# Altium schematic sheet 继电器控制原理图.SCHDOC
size A4
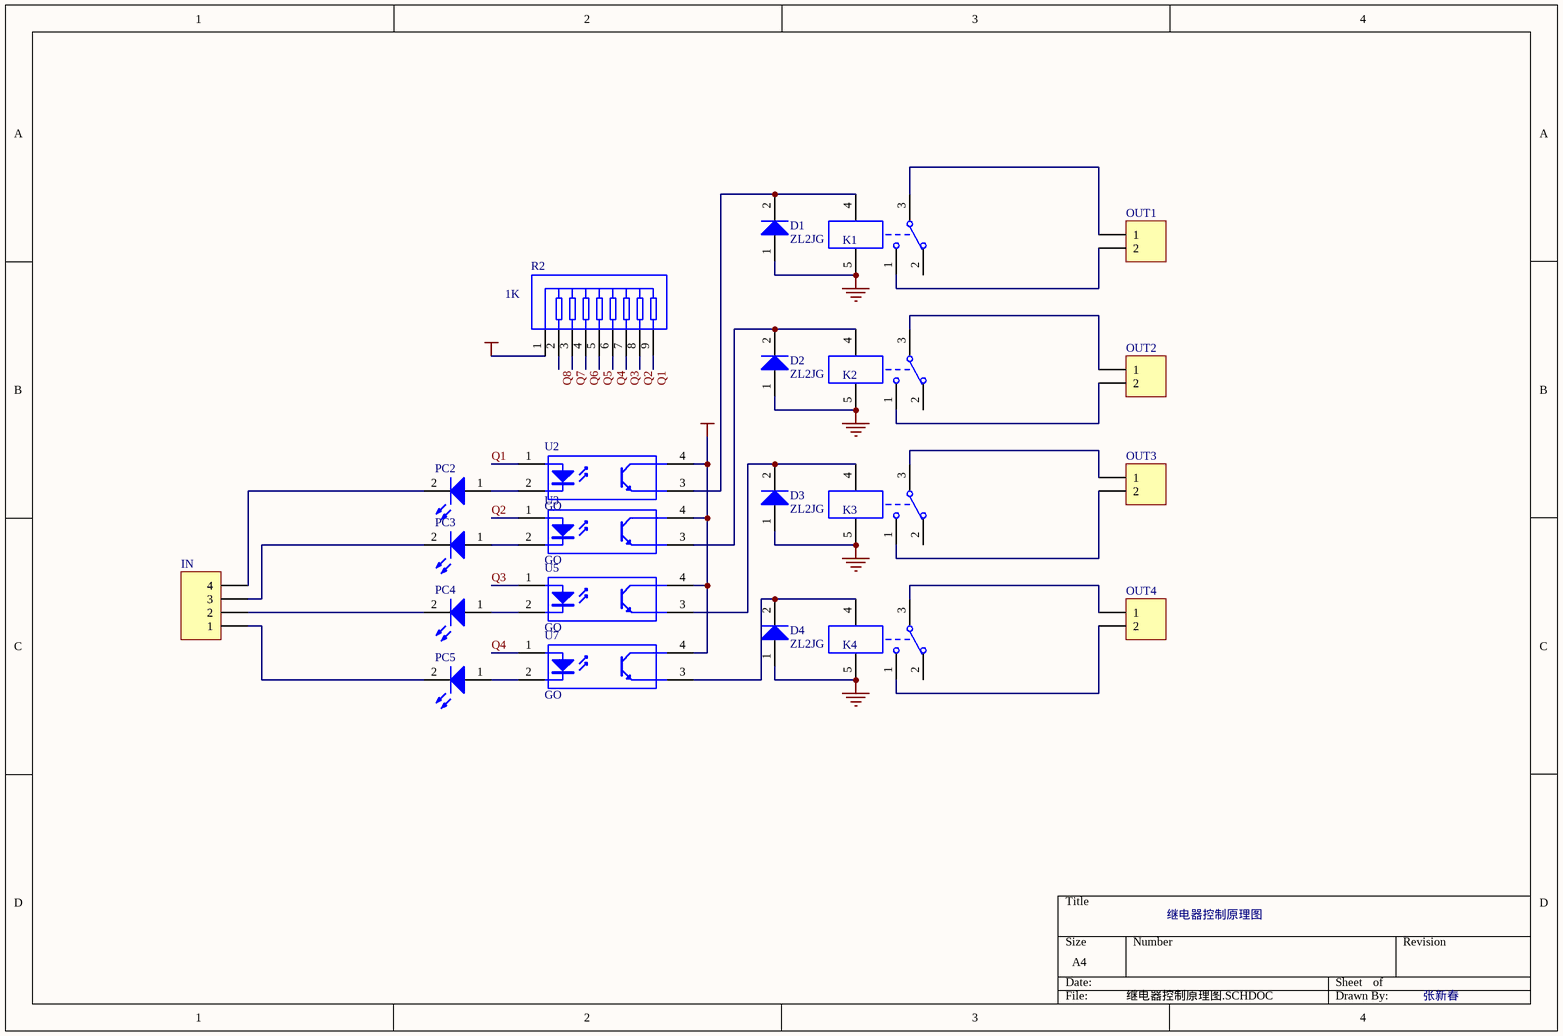
[diagram p0: 继电器控制原理图.SCHDOC]

## Parts
D1  ZL2JG  [D-ZL-10]
D2  ZL2JG  [D-ZL-10]
D3  ZL2JG  [D-ZL-10]
D4  ZL2JG  [D-ZL-10]
IN  Header 4  [HDR1X4]  (value not drawn)
K1  JDQYCK  [JQC-3F/T73]  (value not drawn)
K2  JDQYCK  [JQC-3F/T73]  (value not drawn)
K3  JDQYCK  [JQC-3F/T73]  (value not drawn)
K4  JDQYCK  [JQC-3F/T73]  (value not drawn)
OUT1  PZ_2  [DYDZ]  (value not drawn)
OUT2  PZ_2  [DYDZ]  (value not drawn)
OUT3  PZ_2  [DYDZ]  (value not drawn)
OUT4  PZ_2  [DYDZ]  (value not drawn)
PC2  (no value)  [CPDR]
PC3  (no value)  [CPDR]
PC4  (no value)  [CPDR]
PC5  (no value)  [CPDR]
R2  value 1K  [HDR-10]
U2  GO  [DIP-4]
U3  GO  [DIP-4]
U5  GO  [DIP-4]
U7  GO  [DIP-4]

## Nets
+12V: U2.4(C) U3.4(C) U5.4(C) U7.4(C)
GND: D1.1(A) D2.1(A) D3.1(A) D4.1(A) K1.5 K2.5 K3.5 K4.5
VCC: R2.1
Q1: R2.9 U2.1(A)
Q2: R2.8 U3.1(A)
Q3: R2.7 U5.1(A)
Q4: R2.6 U7.1(A)
Q5: R2.5
Q6: R2.4
Q7: R2.3
Q8: R2.2
NetD1_2: D1.2(K) K1.4 U2.3(E)
NetD2_2: D2.2(K) K2.4 U3.3(E)
NetD3_2: D3.2(K) K3.4 U5.3(E)
NetD4_2: D4.2(K) K4.4 U7.3(E)
NetIN_1: IN.1 PC5.2(K)
NetIN_2: IN.2 PC4.2(K)
NetIN_3: IN.3 PC3.2(K)
NetIN_4: IN.4 PC2.2(K)
NetK1_1: K1.1 OUT1.2
NetK1_3: K1.3 OUT1.1
NetK2_1: K2.1 OUT2.2
NetK2_3: K2.3 OUT2.1
NetK3_1: K3.1 OUT3.2
NetK3_3: K3.3 OUT3.1
NetK4_1: K4.1 OUT4.2
NetK4_3: K4.3 OUT4.1
NetPC2_1: PC2.1(A) U2.2(K)
NetPC3_1: PC3.1(A) U3.2(K)
NetPC4_1: PC4.1(A) U5.2(K)
NetPC5_1: PC5.1(A) U7.2(K)

Not connected (* = marked no-connect by the designer): K1 2; K2 2; K3 2; K4 2

## Notes on the sheet
- 继电器控制原理图
- 张新春

## Library data of the parts
D1-D4 = ZL2JG: 整流二极管; Published: 8-Jun-2000; LatestRevisionDate: 17-Jul-2002; LatestRevisionNote: Re-released for DXP Platform.; DatasheetDocument: 1998; PackageDocument: Aug-1999; PackageReference: DO-201AD; Publisher: Altium Limited
IN = Header 4: Header, 4-Pin; LatestRevisionDate: 17-Jul-2002; LatestRevisionNote: Re-released for DXP Platform.; Publisher: Altium Limited
K1-K4 = JDQYCK: 继电器——1常开1常闭; Published: 24-Mar-1999; LatestRevisionDate: 17-Jul-2002; LatestRevisionNote: Re-released for DXP Platform.; Publisher: Altium Limited
OUT1-OUT4 = PZ_2: 排针——2; LatestRevisionDate: 17-Jul-2002; LatestRevisionNote: Re-released for DXP Platform.; Publisher: Altium Limited
PC2-PC5 = LED: 发光二极管; Published: 8-Jun-2000; LatestRevisionDate: 17-Jul-2002; LatestRevisionNote: Re-released for DXP Platform.; Publisher: Altium Limited
R2 = Res PZ_8: 8位排阻; Published: 24-Mar-1999; LatestRevisionDate: 17-Jul-2002; LatestRevisionNote: Re-released for DXP Platform.; Publisher: Altium Limited; Code_JEDEC: MO-150-AC
U2 U3 U5 U7 = GO: 光耦; Published: 24-Mar-1999; LatestRevisionDate: 17-Jul-2002; LatestRevisionNote: Re-released for DXP Platform.; Publisher: Altium Limited